# EAGLE design DoubleAmp (EAGLE 7.7.0)
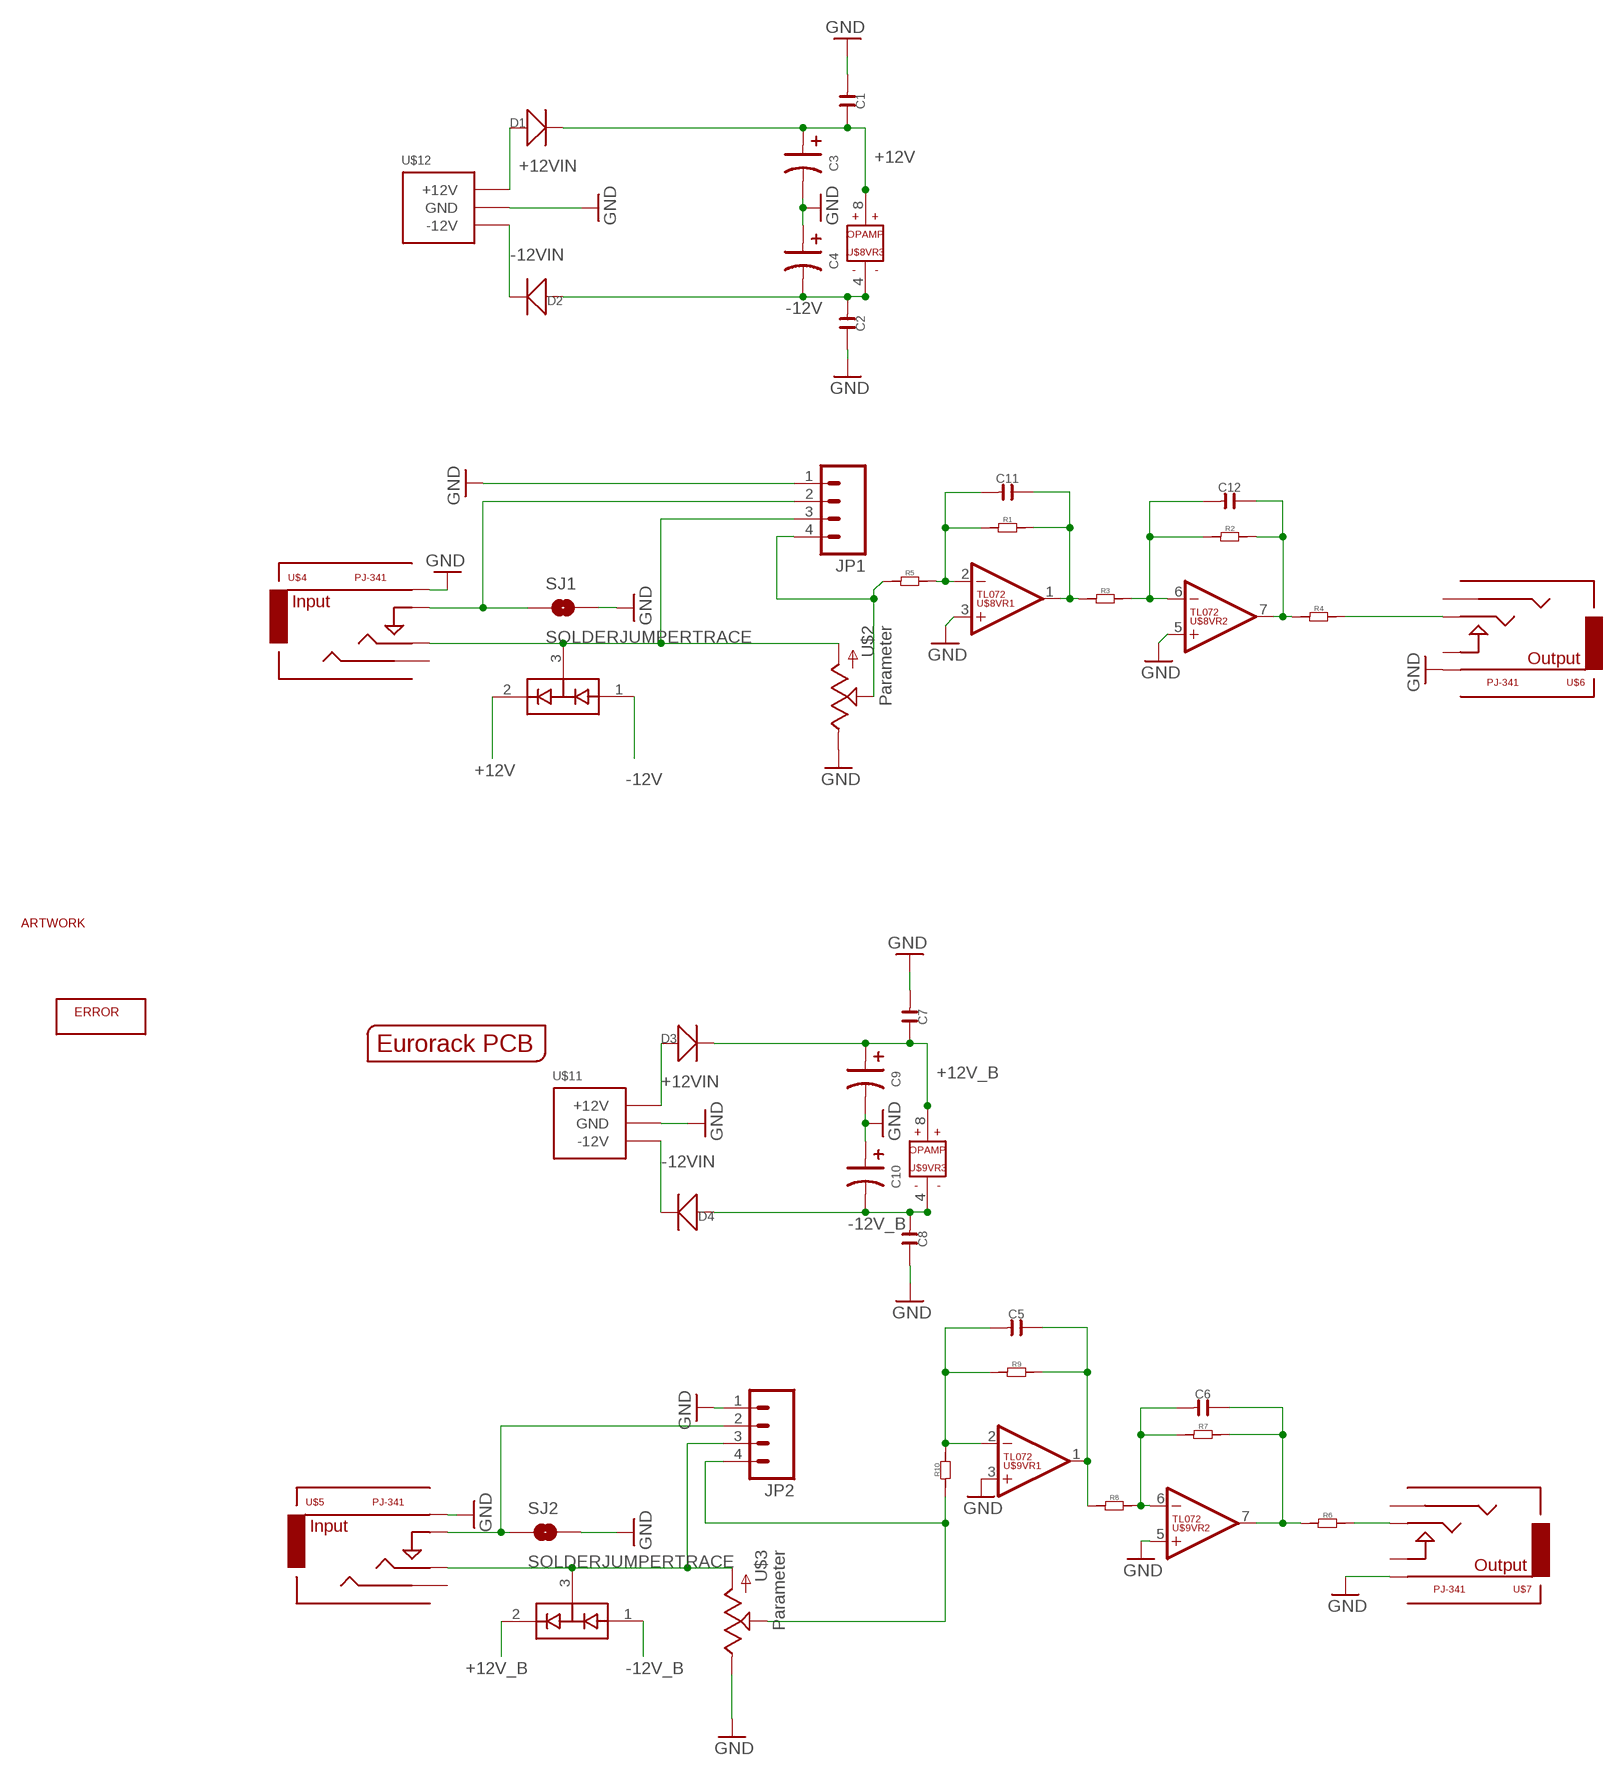
[diagram p0: schematic, sheet 1]

## Parts
C1  C-0603  [C0603]
C2  C-0603  [C0603]
C3  C-POLAR-A  [AVX-A]
C4  C-POLAR-A  [AVX-A]
C5  C-0603  [C0603]
C6  C-0603  [C0603]
C7  C-0603  [C0603]
C8  C-0603  [C0603]
C9  C-POLAR-A  [AVX-A]
C10  C-POLAR-A  [AVX-A]
C11  C-0603  [C0603]
C12  C-0603  [C0603]
D1  D-SMA  [DO-214AC]
D2  D-SMA  [DO-214AC]
D3  D-SMA  [DO-214AC]
D4  D-SMA  [DO-214AC]
D5  BAV99  [SOT23]
D6  BAV99  [SOT23]
JP1  M04PTH  [1X04]
JP2  M04PTH  [1X04]
R1  R-0603  [R0603]
R2  R-0603  [R0603]
R3  R-0603  [R0603]
R4  R-0603  [R0603]
R5  R-0603  [R0603]
R6  R-0603  [R0603]
R7  R-0603  [R0603]
R8  R-0603  [R0603]
R9  R-0603  [R0603]
R10  R-0603  [R0603]
SJ1  SOLDERJUMPERTRACE  [SJ_2S-TRACE]
SJ2  SOLDERJUMPERTRACE  [SJ_2S-TRACE]
U$1  EURORACK_PCB4HP  [EURORACK4HPPCB]
U$2  POTZEPHPOT  [OG-POTS_ALPS_POT_VERTICAL]
U$3  POTZEPHPOT  [OG-POTS_ALPS_POT_VERTICAL]
U$4  PJ-341  AUDIO-JACKINPUT  [3.5MM-JACK-SWITCH-13MM-INPUT]
U$5  PJ-341  AUDIO-JACKINPUT  [3.5MM-JACK-SWITCH-13MM-INPUT]
U$6  PJ-341  AUDIO-JACKOUTPUT  [3.5MM-JACK-SWITCH-13MM-OUTPUT]
U$7  PJ-341  AUDIO-JACKOUTPUT  [3.5MM-JACK-SWITCH-13MM-OUTPUT]
U$8  TL072  [SO08]
U$9  TL072  [SO08]
U$10  ERRORLOGOBIGGER  [ERRORLOGO_BIGGER]
U$11  POWER_SIMPLE  [2X05_SMT_HEADER]
U$12  POWER_SIMPLE  [2X05_SMT_HEADER]
U$13  TINRS_ARTWORKROCKET  [TINRS_ROCKET]

## Nets
+12V [PWR]: C1.2 C3.+ D1.2(-) D6.2(C2) U$8.8(VR3:V+)
+12V_B [PWR]: C7.2 C9.+ D3.2(-) D5.2(C2) U$9.8(VR3:V+)
+12VIN [PWR]: D1.1(+) D3.1(+) U$11.9(+12V) U$11.10(+12V) U$12.9(+12V) U$12.10(+12V)
-12V [PWR]: C2.1 C4.- D2.1(+) D6.1(A1) U$8.4(VR3:V-)
-12V_B [PWR]: C8.1 C10.- D4.1(+) D5.1(A1) U$9.4(VR3:V-)
-12VIN [PWR]: D2.2(-) D4.2(-) U$11.1(-12V) U$11.2(-12V) U$12.1(-12V) U$12.2(-12V)
GND [GND]: C1.1 C2.2 C3.- C4.+ C7.1 C8.2 C9.- C10.+ JP1.1 JP2.1 SJ1.2 SJ2.2 U$2.P$1(E) U$3.P$1(E) U$4.RING@3(RING) U$5.RING@3(RING) U$6.RING@3(RING) U$7.RING@3(RING) U$8.3(VR1:+IN) U$8.5(VR2:+IN) U$9.3(VR1:+IN) U$9.5(VR2:+IN) U$11.3(GND) U$11.4(GND) U$11.5(GND) U$11.6(GND) U$11.7(GND) U$11.8(GND) U$12.3(GND) U$12.4(GND) U$12.5(GND) U$12.6(GND) U$12.7(GND) U$12.8(GND)
N$1: D6.3(COM) JP1.3 U$2.P$3(A) U$4.TIP@3(TIP)
N$2: R4.2 U$6.TIP@3(TIP)
N$3: R6.2 U$7.TIP@3(TIP)
N$4: D5.3(COM) JP2.3 U$3.P$3(A) U$5.TIP@3(TIP)
N$5: JP2.4 R10.1 U$3.P$2(S)
N$10: C11.2 R1.2 R3.1 U$8.1(VR1:OUT)
N$11: C6.2 R6.1 R7.2 U$9.7(VR2:OUT)
N$12: C6.1 R7.1 R8.2 U$9.6(VR2:-IN)
N$13: C5.1 R9.1 R10.2 U$9.2(VR1:-IN)
N$14: C12.1 R2.1 R3.2 U$8.6(VR2:-IN)
N$15: C12.2 R2.2 R4.1 U$8.7(VR2:OUT)
N$16: C11.1 R1.1 R5.2 U$8.2(VR1:-IN)
N$17: JP1.2 SJ1.1 U$4.SWITCH@3(SWITCH)
N$18: JP1.4 R5.1 U$2.P$2(S)
N$19: C5.2 R8.1 R9.2 U$9.1(VR1:OUT)
N$21: JP2.2 SJ2.1 U$5.SWITCH@3(SWITCH)
Unconnected: U$4.SECOND@3(SECOND) U$5.SECOND@3(SECOND) U$6.SECOND@3(SECOND) U$6.SWITCH@3(SWITCH) U$7.SECOND@3(SECOND) U$7.SWITCH@3(SWITCH)

## Library data of the parts
C1 C2 C5-C8 C11 C12 = OPL:C*
C3 C4 C9 C10 = EurorackModularParts:C-POLAR*
D1-D4 = OPL:D*: DIODE
D5 D6 = SparkFun-DiscreteSemi:BAV99: Two small signal silicon diodes connected anode to cathode. Connections to all three nodes available. DIO-10647; PROD_ID: DIO-10647
JP1 JP2 = SparkFun-Connectors:M04: Header 4 Standard 4-pin 0.1" header. Use with straight break away headers (SKU : PRT-00116), right angle break away headers (PRT-00553), swiss pins (PRT-00743), machine pins (PRT-00117), and female headers (PRT-00115). Molex polarized connector foot print use with SKU : PRT-08231 with associated crimp pins and housings. 1MM SMD Version SKU: PRT-10208
R1-R10 = OPL:R*
SJ1 SJ2 = SparkFun-Passives:SOLDERJUMPER: Solder Jumper Standard SMD solder jumper. Used to automate production. Two varients : Normally Open and Normally Closed are the same, but have different paste layers. NC will have a large amount of paste and should jumper during reflow.
U$1 = EurorackModularParts:EURORACK_PCB
U$2 U$3 = EurorackModularParts:POT; DESC: Parameter
U$4 U$5 = EurorackModularParts:AUDIO-JACK: Switching Mono 3.5mm Audio Jack from Erthenvar.; DESC: Input; MPN: PJ-341
U$6 U$7 = EurorackModularParts:AUDIO-JACK: Switching Mono 3.5mm Audio Jack from Erthenvar.; DESC: Output; MPN: PJ-341
U$8 U$9 = EurorackModularParts:TL072
U$10 = EurorackModularParts:ERRORLOGO
U$11 U$12 = EurorackModularParts:POWER_SIMPLE
U$13 = EurorackModularParts:TINRS_ARTWORK

## Net classes
0 default: width 0.254 mm
1 GND: width 0.381 mm
2 PWR: width 0.432 mm

## Board
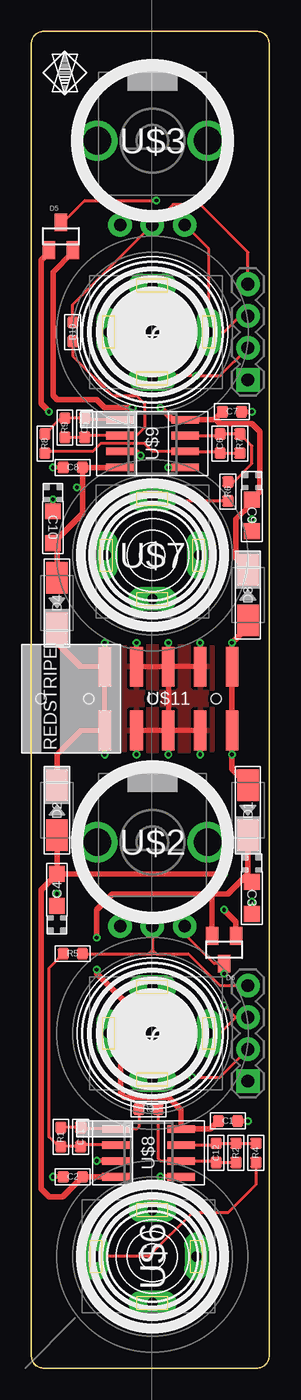
[diagram p1: board, top side]
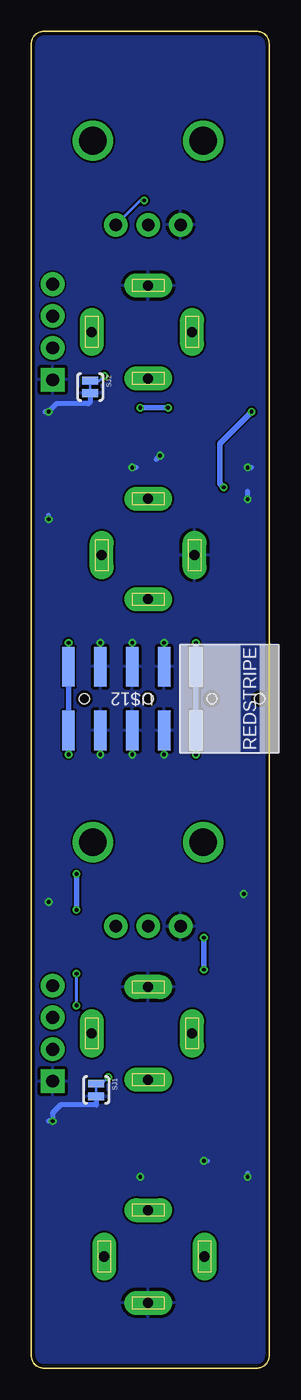
[diagram p2: board, bottom side, seen from below]

Size 18.98 x 106.5 mm. Coordinates in mm from the lower left corner, seen from the top.
Copper layers (1*16): Top 0.035mm / dielectric 1.5mm / Bottom 0.035mm
Design rules "ITEADstudio_DRC": minimum track width 6mil, minimum drill 12mil, track to track 6mil, track to pad 6mil, pad to pad 6mil, via to via 6mil, smd to smd 0mil, copper to edge 10mil, drill to drill 10mil, minimum pad ring 10mil, minimum via ring 6mil, stop-mask expansion 2mil, vias tented up to drill 100mil, thermal gap 10mil
Holes 0.8 mm at 9.66,53.34 0.77,53.34 4.58,53.34 14.74,53.34

### Footprints (pad centres in the part's own frame; a part is rotated, then mirrored left to right if it is on the bottom)
C0603 = smd 0.889 x 0.889: 1 -0.762,0; 2 0.762,0
AVX-A = smd 1.27 x 1.27: + -1.27,0; - 1.27,0
DO-214AC = smd 2.5 x 1.7: 1 -2,0; 2 2,0
SOT23 = smd 1 x 1.4: 1 -0.95,-1.1; 2 0.95,-1.1; 3 0,1.1
1X04 = drill 1.016 pad 1.88 square: 1 0,0 | drill 1.016 pad 1.88: 2 2.54,0; 3 5.08,0; 4 7.62,0
R0603 = smd 0.889 x 0.889: 1 -0.762,0; 2 0.762,0
SJ_2S-TRACE = smd 0.635 x 1.27: 1 -0.508,0; 2 0.508,0
OG-POTS_ALPS_POT_VERTICAL = drill 1 pad 1.88: P$1 -2.58,-6.7; P$2 0,-6.7; P$3 2.58,-6.7 | drill 2.2 pad 3.175: P$4 4.4,0; P$5 -4.4,0
3.5MM-JACK-SWITCH-13MM-INPUT = drill 0.8 pad 1.93 long: RING@3 -3.7,0; SECOND@3 0,-3.5; SWITCH@3 3.7,0; TIP@3 0,4.5
3.5MM-JACK-SWITCH-13MM-OUTPUT = drill 0.8 pad 1.93 long: RING@3 -3.7,0; SECOND@3 0,-3.5; SWITCH@3 3.7,0; TIP@3 0,4.5
SO08 = smd 0.6 x 2.2: 1 -1.905,-2.6; 2 -0.635,-2.6; 3 0.635,-2.6; 4 1.905,-2.6; 5 1.905,2.6; 6 0.635,2.6; 7 -0.635,2.6; 8 -1.905,2.6
2X05_SMT_HEADER = smd 1 x 3.17: 1 -5.08,-2.54; 2 -5.08,2.54; 3 -2.54,-2.54; 4 -2.54,2.54; 5 0,-2.54; 6 0,2.54; 7 2.54,-2.54; 8 2.54,2.54; 9 5.08,-2.54; 10 5.08,2.54

### Placement (x,y rotation side)
C1  15.69,19.68 180 top
C2  3.31,15.24 180 top
C3  17.6,37.47 270 top
C4  2.04,38.1 90 top
C5  4.26,74.93 90 top
C6  15.06,73.66 90 top
C7  16.01,76.2 180 top
C8  3.31,71.75 180 top
C9  17.6,67.94 270 top
C10  1.72,66.99 270 top
C11  3.95,18.41 90 top
C12  14.74,17.14 90 top
D1  17.28,44.45 270 top
D2  2.04,44.45 90 top
D3  17.28,61.59 90 top
D4  2.04,60.96 270 top
D5  2.36,90.17 0 top
D6  15.38,33.34 180 top
JP1  17.28,22.86 90 top
JP2  17.28,78.74 90 top
R1  2.36,18.41 90 top
R2  16.33,17.14 90 top
R3  9.34,20.64 0 top
R4  17.91,17.14 270 top
R5  3.31,33.02 180 top
R6  15.69,69.85 270 top
R7  16.64,73.66 90 top
R8  1.09,73.66 270 top
R9  2.67,74.93 90 top
R10  3.31,82.55 270 top
SJ1  13.8,22.16 270 bottom
SJ2  14.28,78.17 270 bottom
U$1  -0.5,0 0 top
U$2  9.66,41.91 0 top
U$3  9.66,97.79 0 top
U$4  9.66,26.67 270 top
U$5  9.66,82.55 270 top
U$6  9.66,8.89 90 top
U$7  9.66,64.77 0 top
U$8  9.34,17.14 270 top
U$9  9.66,73.66 270 top
U$10  ERRORLOGO  [ERRORLOGO]  2.67,103.19 0 top
U$11  10.93,53.34 0 top
U$12  10.93,53.34 180 bottom
U$13  31.88,97.16 180 top  (outside the outline)

### Tracks (layer width: path | path; a pad name or v marks a point on that pad's centre or on a via)
+12V  (via drill 0.3)
  Top 0.432: C1.2 14.3,19.05 U$8.8 11.94,20.58 10.93,21.59 7.44,21.59 7.12,21.91 7.12,24.13 7.76,24.77 7.76,28.89 5.21,31.43 v5.21,31.75 | 17.6,39.05 C3.+ 17.28,39.37 | v5.21,34.29 5.21,36.51 6.49,37.78 14.42,37.78 | D1.2 17.28,39.37 | 17.28,39.37 15.69,37.78 14.42,37.78 | 14.42,37.78 14.42,35.39 D6.2
  Bottom 0.432: v5.21,34.29 v5.21,31.75
+12V_B  (via drill 0.3)
  Top 0.432: 14.61,75.56 U$9.8 11.25,75.56 v10.29,76.52 | 14.61,75.56 C7.2 | 14.61,75.56 14.74,75.56 15.06,75.25 17.6,75.25 18.23,74.61 18.23,69.85 C9.+ 17.6,68.9 16.33,67.63 16.33,64.55 D3.2 | D5.2 3.31,88.9 1.72,87.31 1.72,77.47 2.04,77.15 5.21,77.15 5.85,76.52 v8.07,76.52
  Bottom 0.432: v10.29,76.52 v8.07,76.52
+12VIN  (via drill 0.3)
  Top 0.432: D1.1 16.01,47.72 v16.01,48.9 U$11.9 U$11.10 v16.01,57.78 17.28,59.05 D3.1
  Bottom 0.432: U$11.10 U$11.9 v16.01,48.9
-12V  (via drill 0.3)
  Top 0.432: C4.- 0.77,38.1 0.77,14.29 1.41,13.65 2.48,13.65 C2.1 U$8.4 | C4.- v15.38,39.37 | v15.38,36.51 16.32,35.56 D6.1 | D2.1 C4.-
  Bottom 0.432: v15.38,39.37 v15.38,36.51
-12V_B  (via drill 0.3)
  Top 0.432: U$9.4 C8.1 4.07,70.17 | 4.07,70.17 4.07,68.07 C10.- 2.04,65.41 D4.1 | D5.1 1.41,88.9 0.77,88.27 0.77,76.83 v1.41,76.2 | v3.63,70.17 4.07,70.17
  Bottom 0.432: v1.41,76.2 3.95,73.66 3.95,70.48 v3.63,70.17
-12VIN  (via drill 0.3)
  Top 0.432: U$11.2 U$11.1 | U$11.2 3.95,55.88 2.04,57.78 D4.2 | U$11.2 v5.85,57.78 | U$11.1 3.95,50.8 2.04,48.9 D2.2 | U$11.1 v5.85,48.9
  Bottom 0.432: v5.85,57.78 U$11.2 U$11.1 v5.85,48.9
GND  (via drill 0.3)
  Top 0.381: U$12.5 U$12.6 | U$12.6 10.93,50.48 11.25,50.16 | U$12.6 U$12.4 v8.39,48.9 | U$12.6 U$12.8 v13.47,48.9 | U$12.5 U$12.3 v8.39,57.78 | U$12.5 U$12.7 v13.47,57.78 | U$12.5 v10.93,57.78 | v10.93,48.9 U$12.6 | U$9.3 8.39,73.03 v8.71,72.71 | C8.2 v1.72,71.75 | U$9.5 v10.93,71.75 | C7.1 v17.6,76.2 | C10.+ v1.72,69.22 | C9.- v17.6,67.63 | C3.- v17.6,37.15 | C4.+ v2.04,37.78 | C2.2 v1.72,15.24 | U$8.3 v5.21,16.51 | U$8.5 v10.29,15.24 | C1.1 v17.28,19.68
  Bottom 0.381: v8.71,72.71 9.03,72.39 | v1.72,71.75 1.41,71.75 | v10.93,71.75 10.61,71.75 | 17.91,76.2 v17.6,76.2 16.96,76.83 14.42,76.83 14.28,76.98 SJ2.2 | v1.72,69.22 1.72,69.85 | v17.6,67.63 17.6,67.94 | v1.72,15.24 1.72,15.56 | v5.21,16.51 4.9,16.51 | 17.6,19.68 v17.28,19.68 17.28,20.32 16.64,20.95 13.79,20.95 13.8,20.97 SJ1.2
  pour Bottom: -1.77,110.49 23.63,110.49 23.63,-5.08 -1.77,-5.08
  pour Top: 7.44,57.47 14.42,57.47 14.42,49.21 7.44,49.21
N$1  (via drill 0.3)
  Top 0.254: JP1.3 16.33,27.94 | U$4.TIP@3 15.06,26.67 16.33,27.94 | 16.33,27.94 v15.38,28.89 | v15.38,31.43 D6.3 14.57,32.24 12.2,34.61 12.2,35.17 U$2.P$3
  Bottom 0.254: v15.38,28.89 v15.38,31.43
N$2
  Top 0.254: R4.2 17.91,14.61 15.69,12.38 12.84,12.38 9.34,8.89 U$6.TIP@3
N$3
  Top 0.254: R6.2 9.84,69.09 U$7.TIP@3
N$4  (via drill 0.3)
  Top 0.254: U$3.P$3 14.16,89.17 U$5.TIP@3 15.38,82.55 16.64,83.82 JP2.3 16.96,83.82 | D5.3 2.5,91.27 4.26,93.03 v9.98,93.03
  Bottom 0.254: v9.98,93.03 10.3,93.03 U$3.P$3
N$5
  Top 0.254: JP2.4 17.28,88.9 13.47,92.71 11.28,92.71 U$3.P$2 | U$3.P$2 9.5,91.09 | R10.1 3.31,84.74 U$3.P$2
N$10
  Top 0.254: R1.2 C11.2 4.07,19.05 U$8.1 8.39,19.05 8.58,19.24 R3.1
N$11
  Top 0.254: U$9.7 14.93,74.3 C6.2 R7.2 17.6,73.47 17.6,72.07 16.14,70.61 R6.1
N$12
  Top 0.254: R7.1 C6.1 14.93,73.03 U$9.6 9.66,73.03 9.03,73.66 5.53,73.66 4.9,73.03 1.21,73.03 R8.2
N$13
  Top 0.254: R9.1 C5.1 4.39,74.3 U$9.2 8.39,74.3 9.03,74.93 9.03,76.83 8.39,77.47 6.49,77.47 3.31,80.64 R10.2
N$14
  Top 0.254: R3.2 10.1,16.7 10.29,16.51 U$8.6 | U$8.6 12.84,16.51 | U$8.6 14.61,16.51 C12.1 R2.1
N$15
  Top 0.254: U$8.7 14.61,17.78 C12.2 R2.2 R4.1
N$16
  Top 0.254: U$8.2 4.07,17.78 C11.1 R1.1 2.17,17.65 1.41,18.41 1.41,31.88 R5.2
N$17  (via drill 0.3)
  Top 0.254: U$4.SWITCH@3 9.87,23.18 v12.84,23.18 15.06,23.18 JP1.2
  Bottom 0.254: SJ1.1 13.35,22.67 v12.84,23.18
N$18
  Top 0.254: 9.63,35.21 U$2.P$2 9.66,33.34 | R5.1 9.34,33.02 | 9.34,33.02 9.66,33.02 | 9.98,33.02 12.52,33.02 15.06,30.48 JP1.4 | 9.66,33.34 9.34,33.02 | 9.66,33.34 9.98,33.02 | 9.98,33.02 9.66,33.02 | 9.66,33.02 9.66,33.34
N$19
  Top 0.254: U$9.1 4.39,75.56 C5.2 R9.2 2.36,75.69 R8.1
N$21  (via drill 0.3)
  Top 0.254: U$5.SWITCH@3 9.87,79.06 v13.15,79.06 15.06,79.06 JP2.2
  Bottom 0.254: SJ2.1 13.53,78.68 v13.15,79.06